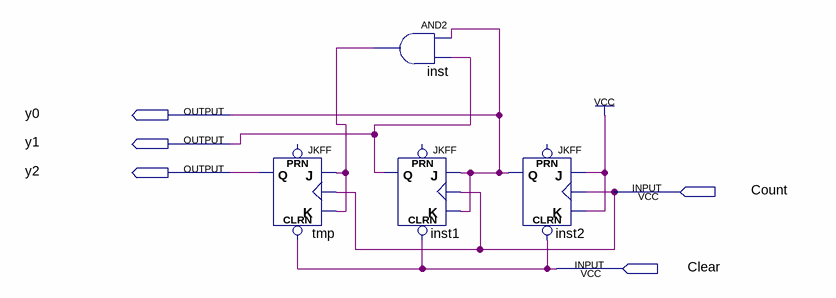
[diagram p0: schematic sheet]
// Quartus schematic figure7.bdf as structural Verilog: 4 symbols, 5 pins
module figure7 (
  input  Count,
  input  Clear,
  output y0,
  output y1,
  output y2
);

  wire inst_out;

  JKFF tmp (.CLRN(Clear), .K(inst_out), .J(inst_out), .CLK(Count), .Q(y2));  // open: PRN
  and inst (inst_out, y0, y1);
  JKFF inst1 (.CLRN(Clear), .K(y0), .J(y0), .CLK(Count), .Q(y1));  // open: PRN
  JKFF inst2 (.CLRN(Clear), .K(1'b1), .J(1'b1), .CLK(Count), .Q(y0));  // open: PRN
endmodule
